# Altium schematic sheet Power_In_PCDuino.SchDoc
size Letter
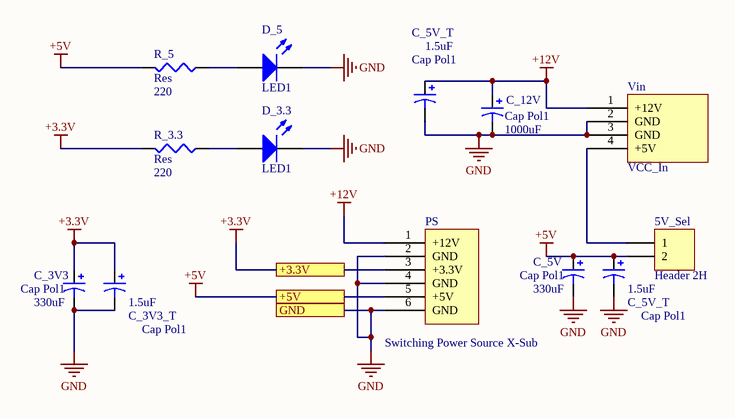
[diagram p0: Power_In_PCDuino.SchDoc]

## Parts
(Parts that share a designator on the sheet are numbered #1, #2 ... from top to bottom, then left to right.)
5V_Sel  Header 2H  [HDR1X2H]
C_3V3  Cap Pol1  value 330uF  [C Panasonic Size Cap Pol]
C_3V3_T  Cap Pol1  value 1.5uF  [6-0805_L]
C_5V  Cap Pol1  value 330uF  [C Panasonic Size Cap Pol]
C_5V_T#1  Cap Pol1  value 1.5uF  [6-0805_L]
C_5V_T#2  Cap Pol1  value 1.5uF  [6-0805_L]
C_12V  Cap Pol1  value 1000uF  [C Panasonic Size Cap Pol]
D_3.3  LED1  [LED-1]
D_5  LED1  [LED-1]
PS  Switching Power Source X-Sub  [Fuente_Switching]
R_3.3  Res  value 220  [J1-0603]
R_5  Res  value 220  [J1-0603]
Vin  VCC_In  [Vcc_In]

## Ports
+3.3V, +5V, GND

## Nets
+3.3V: C_3V3.1 C_3V3_T.1 PS.3(+3.3V) R_3.3.2 ; port +3.3V
+5V: 5V_Sel.2 C_5V.1 C_5V_T#2.1 PS.5(+5V) R_5.2 ; port +5V
+12V: C_5V_T#1.1 C_12V.1 PS.1(+12V) Vin.1(+12V)
GND: C_3V3.2 C_3V3_T.2 C_5V.2 C_5V_T#1.2 C_5V_T#2.2 C_12V.2 D_3.3.2(K) D_5.2(K) PS.2(GND) PS.4(GND) PS.6(GND) Vin.2(GND) Vin.3(GND) ; port GND
Net5V_Sel_1: 5V_Sel.1 Vin.4(+5V)
NetD_3.3_1: D_3.3.1(A) R_3.3.1
NetD_5_1: D_5.1(A) R_5.1

## Library data of the parts
5V_Sel = Header 2H: Header, 2-Pin, Right Angle; LatestRevisionDate: 17-Jul-2002; LatestRevisionNote: Re-released for DXP Platform.; Publisher: Altium Limited
C_3V3 C_5V C_12V = Cap Pol1: Polarized Capacitor (Radial); Published: 8-Jun-2000; LatestRevisionDate: 17-Jul-2002; LatestRevisionNote: Re-released for DXP Platform.; PackageReference: RB7.6-15; Publisher: Altium Limited; PackageDescription: Polarized Capacitor (Radial); 2 Leads
C_3V3_T C_5V_T#1 C_5V_T#2 = Cap Pol1: Tantalum; Published: 8-Jun-2000; LatestRevisionDate: 17-Jul-2002; LatestRevisionNote: Re-released for DXP Platform.; PackageReference: RB7.6-15; Publisher: Altium Limited; PackageDescription: Polarized Capacitor (Radial); 2 Leads
D_3.3 D_5 = LED1: Typical RED GaAs LED; Published: 8-Jun-2000; LatestRevisionDate: 08-Jul-2005; LatestRevisionNote: Mech Layer 1 removed.; PackageReference: LED-1; Publisher: Altium Limited; PackageDescription: LED; 2 Leads
R_3.3 R_5 = Res3: Resistor; Published: 8-Jun-2000; LatestRevisionDate: 29-May-2009; LatestRevisionNote: IPC-7351 Footprint Added.; PackageReference: J1-0603; Publisher: Altium Limited; PackageDescription: Chip Resistor
Vin = VCC_In: pin to pad: 1>0 2>1 3>2 4>3